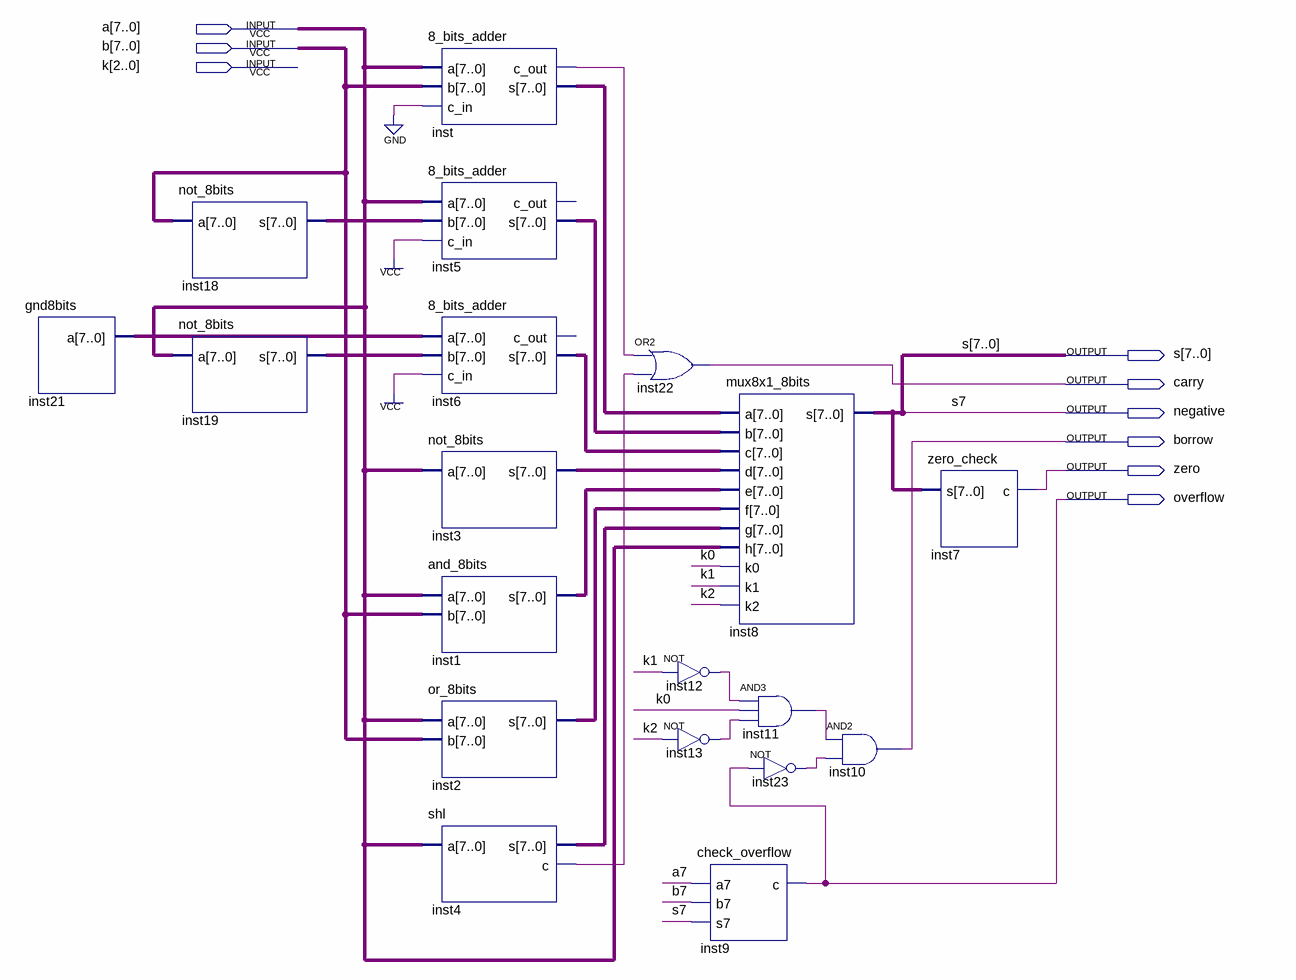
[diagram p0: schematic sheet]
// Quartus schematic ahmes_alu.bdf as structural Verilog: 19 symbols, 9 pins
module ahmes_alu (
  input  [7:0] a,
  input  [7:0] b,
  input  [2:0] k,
  output [7:0] s,
  output carry,
  output negative,
  output borrow,
  output zero,
  output overflow
);

  wire inst4_c, inst11_out, inst12_out, inst13_out, inst23_out, inst_c_out;
  wire [7:0] inst1_s, inst2_s, inst3_s, inst4_s, inst5_s, inst6_s, inst18_s, inst19_s, inst21_a, inst_s;

  gnd8bits inst21 (.a(inst21_a));
  not_8bits inst18 (.a(b), .s(inst18_s));
  not_8bits inst19 (.a(a), .s(inst19_s));
  \8_bits_adder  inst (.a(a), .b(b), .c_in(1'b0), .c_out(inst_c_out), .s(inst_s));
  \8_bits_adder  inst5 (.a(a), .b(inst18_s), .c_in(1'b1), .s(inst5_s));  // open: c_out
  \8_bits_adder  inst6 (.a(inst21_a), .b(inst19_s), .c_in(1'b1), .s(inst6_s));  // open: c_out
  not_8bits inst3 (.a(a), .s(inst3_s));
  and_8bits inst1 (.a(a), .b(b), .s(inst1_s));
  or_8bits inst2 (.a(a), .b(b), .s(inst2_s));
  shl inst4 (.a(a), .s(inst4_s), .c(inst4_c));
  or inst22 (carry, inst_c_out, inst4_c);
  not inst12 (inst12_out, k[1]);
  not inst13 (inst13_out, k[2]);
  check_overflow inst9 (.a7(a[7]), .b7(b[7]), .s7(negative), .c(overflow));
  mux8x1_8bits inst8 (
    .a(inst_s), .b(inst5_s), .c(inst6_s), .d(inst3_s), .e(inst1_s), .f(inst2_s), .g(inst4_s), .h(a),
    .k0(k[0]), .k1(k[1]), .k2(k[2]), .s({negative, s[6:0]}));
  and inst11 (inst11_out, inst12_out, k[0], inst13_out);
  not inst23 (inst23_out, overflow);
  and inst10 (borrow, inst11_out, inst23_out);
  zero_check inst7 (.s({negative, s[6:0]}), .c(zero));

  assign s[7] = negative;

  // Other names for the same wires on the sheet: s7 = negative
endmodule
